# EAGLE schematic untitled (EAGLE 6.4)
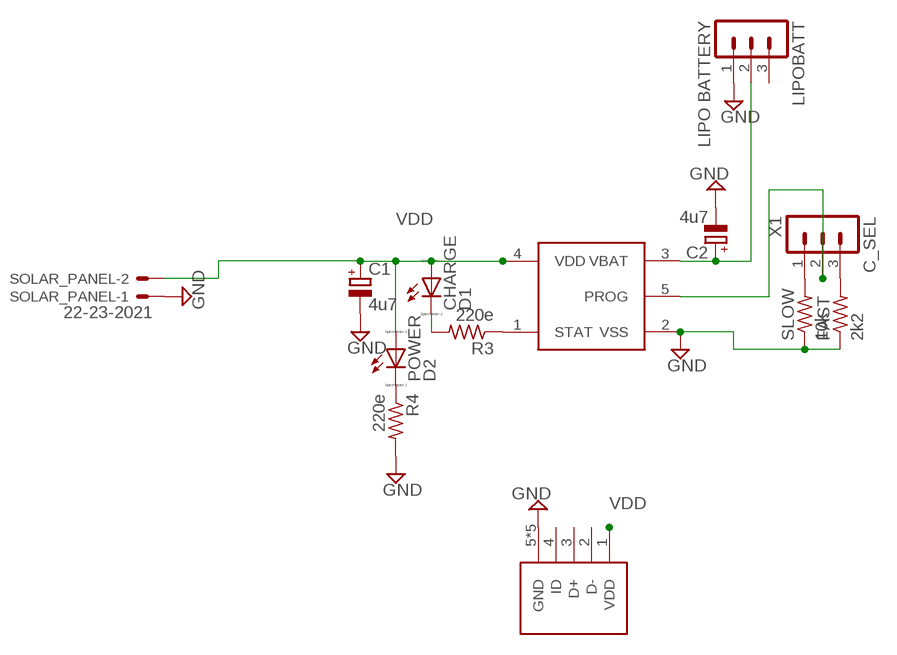
[diagram p0: schematic, sheet 1]

## Parts
C1  4u7  CPOL-EU153CLV-0505  [153CLV-0505]
C2  4u7  CPOL-EU153CLV-0505  [153CLV-0505]
C_SEL  X1  MA03-1  [MA03-1]
CHARGE  D1  LED_E  [LED_1206]
FAST  2k2  R-US_M0805  [M0805]
LIPOBATT  LIPO BATTERY  MA03-1  [MA03-1]
POWER  D2  LED_E  [LED_1206]
R3  220e  R-US_M0805  [M0805]
R4  220e  R-US_M0805  [M0805]
SLOW  10k  R-US_M0805  [M0805]
SOLAR_PANEL  22-23-2021  [22-23-2021]
U$1  MCP73831  [SOT23-5]
USB  2293753  MICRO_USB_RECEP  [UUSB_B_RECEPTABLE]

## Nets
GND: C1.- C2.- FAST.1 LIPOBATT.1 R4.2 SLOW.1 SOLAR_PANEL.1 U$1.2(VSS) USB.5(GND) USB.X1(GND) USB.X2(GND) USB.X3(GND) USB.X4(GND)
N$1: C_SEL.1 SLOW.2
N$2: C_SEL.3 FAST.2
N$4: C_SEL.2 U$1.5(PROG)
N$6: C2.+ LIPOBATT.2 U$1.3(VBAT)
N$7: R3.1 U$1.1(STAT)
N$8: CHARGE.C R3.2
N$9: POWER.C R4.1
VDD: C1.+ CHARGE.A POWER.A SOLAR_PANEL.2 U$1.4(VDD) USB.1(VDD)
Unconnected: LIPOBATT.3 USB.2(D-) USB.3(D+) USB.4(ID)

## Library data of the parts
C1 C2 = rcl:CPOL-EU: POLARIZED CAPACITOR, European symbol
C_SEL LIPOBATT = con-lstb:MA03-1: PIN HEADER; OC_FARNELL: unknown; OC_NEWARK: unknown
CHARGE POWER = eagle-ltspice:LED_E: LED Source: http://www.osram.convergy.de Source: www.luxeon.com Source: www.kingbright.com; SPICEMODEL: NONE; SPICEPREFIX: D; SPICETYPE: diode
FAST R3 R4 SLOW = rcl:R-US_: RESISTOR, American symbol
SOLAR_PANEL = con-molex:22-23-2021: .100" (2.54mm) Center Header - 2 Pin; MF: MOLEX; MPN: 22-23-2021; OC_FARNELL: 1462926; OC_NEWARK: 25C3832
U$1 = lipoLib:MCP73831
USB = lipoLib:MICRO_USB_RECEP